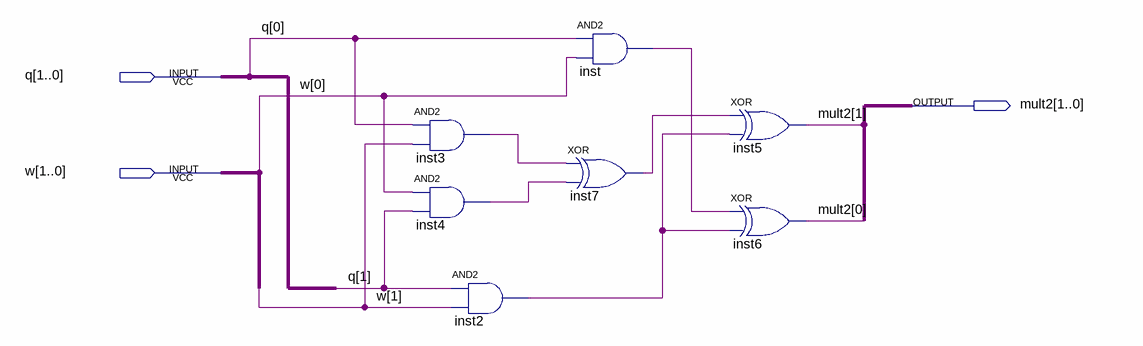
[diagram p0: schematic sheet]
// Quartus schematic 2bitmultiplier.bdf as structural Verilog: 7 symbols, 3 pins
module \2bitmultiplier  (
  input  [1:0] q,
  input  [1:0] w,
  output [1:0] mult2
);

  wire inst2_out, inst3_out, inst4_out, inst7_out, inst_out;

  and inst3 (inst3_out, q[0], w[1]);
  and inst4 (inst4_out, w[0], q[1]);
  and inst2 (inst2_out, q[1], w[1]);
  and inst (inst_out, q[0], w[0]);
  xor inst7 (inst7_out, inst3_out, inst4_out);
  xor inst5 (mult2[1], inst7_out, inst2_out);
  xor inst6 (mult2[0], inst_out, inst2_out);
endmodule
